# Altium schematic sheet Sheet1.SchDoc
size A; SheetNumber: 1; SheetTotal: 1
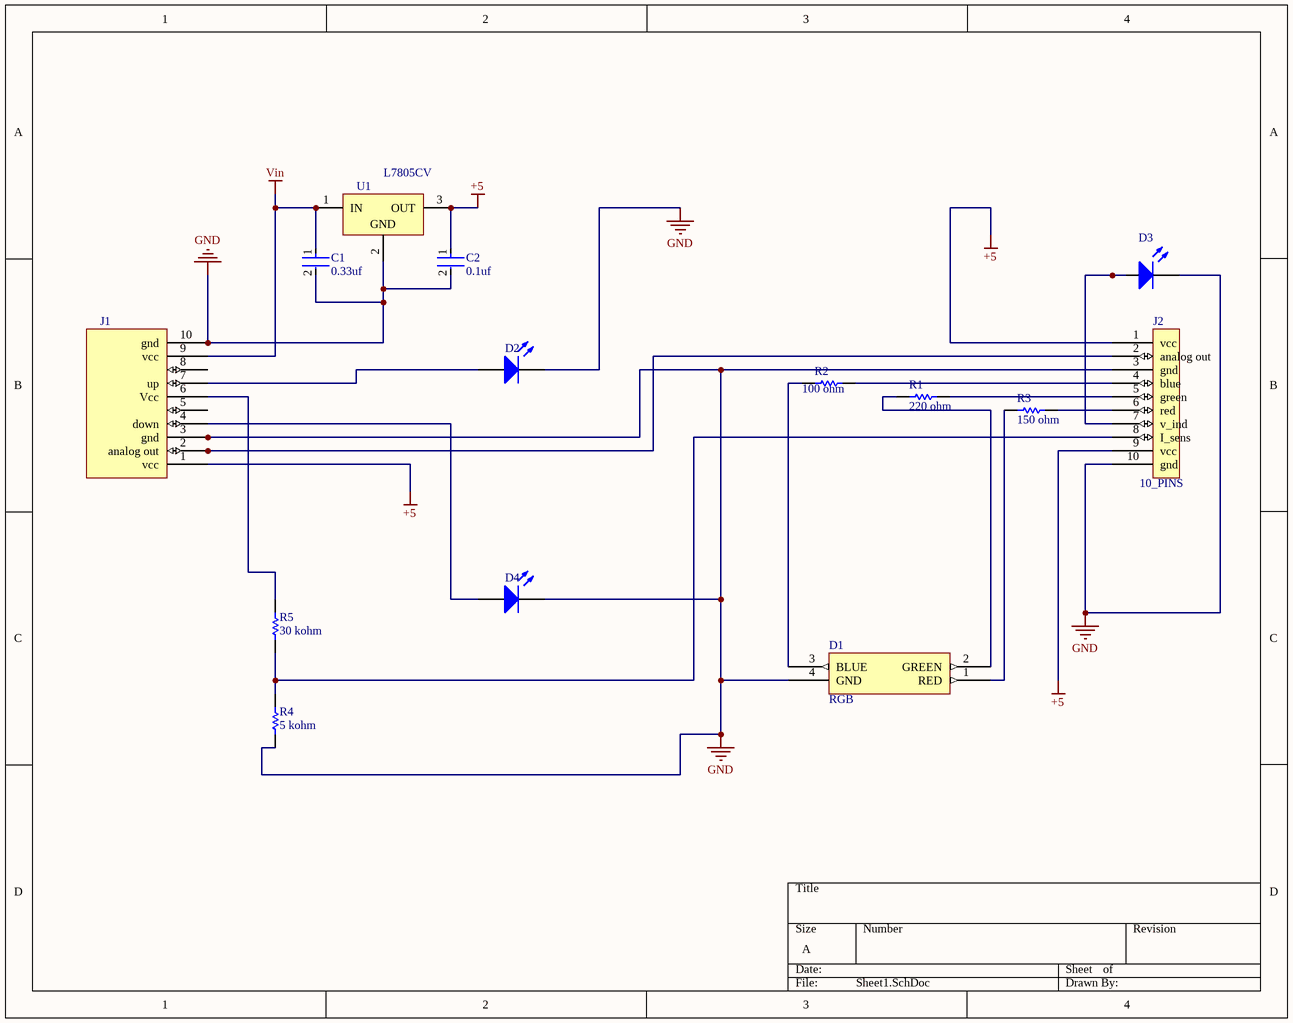
[diagram p0: Sheet1.SchDoc]

## Parts
C1  0.33uf  [FP-K15H5-MFG]
C2  0.1uf  [FP-K15H5-MFG]
D1  RGB  [RGB LED]
D2  Light-Emitting Diode  [LED]  (value not drawn)
D3  Light-Emitting Diode  [LED]  (value not drawn)
D4  Light-Emitting Diode  [LED]  (value not drawn)
J1  (no value)  [pin_10]
J2  10_PINS  [pin_10]
R1  value 220 ohm  [RESISTANCE]  (hidden comment: Resistor)
R2  value 100 ohm  [RESISTANCE]  (hidden comment: Resistor)
R3  value 150 ohm  [RESISTANCE]  (hidden comment: Resistor)
R4  value 5 kohm  [RESISTANCE]  (hidden comment: Resistor)
R5  value 30 kohm  [RESISTANCE]  (hidden comment: Resistor)
U1  L7805CV  [TO220]

## Nets
+5: C2.1 J1.1(vcc) J2.1(vcc) J2.9(vcc) U1.3(OUT)
GND: C1.2 C2.2 D1.4(GND) D2.2(K) D3.2(K) D4.2(K) J1.3(gnd) J1.10(gnd) J2.3(gnd) J2.10(gnd) R4.2 U1.2(GND)
Vin: C1.1 J1.9(vcc) U1.1(IN)
NetD1_1: D1.1(RED) R3.2
NetD1_2: D1.2(GREEN) R1.2
NetD1_3: D1.3(BLUE) R2.2
NetD2_1: D2.1(A) J1.7(up)
NetD3_1: D3.1(A) J2.7(v_ind)
NetD4_1: D4.1(A) J1.4(down)
NetJ1_2: J1.2(analog_out) J2.2(analog_out)
NetJ1_6: J1.6(Vcc) R5.1
NetJ2_4: J2.4(blue) R2.1
NetJ2_5: J2.5(green) R1.1
NetJ2_6: J2.6(red) R3.1
NetJ2_8: J2.8(I_sens) R4.1 R5.2

Not connected (* = marked no-connect by the designer): J1 5 8

## Library data of the parts
C1 C2 = CMP-02417-000078-1: CAP CER 0.1UF 50V X7R RADIAL; Capacitance: 100nF; Tolerance: 10%; Dielectric Material: Ceramic; Lead Length: 30mm; Lead Diameter: 0.5mm; Lead/Base Style: Formed Leads; Diameter: 500um; Max Operating Temperature: 125°C; Case/Package: Dipped; Dielectric: X7R; Lead Free: Lead Free; Construction: RADIAL; Voltage: 50V; Thickness: 2.6mm; Min Operating Temperature: -55°C; Lead Pitch: 5mm; Height: 4mm; Radiation Hardening: No; Voltage Rating: 50V; Depth: 2.5mm; Voltage Rating (DC): 50V; Package Quantity: 1; Weight: 0.005644oz; Series: K; Mount: Through Hole; Termination: Radial; Height - Seated (Max): 0.257inch; Length: 4mm; Packaging: Tape and Reel; Width: 2.5mm; RoHS Compliant: Yes
D1 = RGB LED
D2-D4 = LED: AF: 1; BV: 0; BV_MAX: 1e99; EG: 1.11; FC: 0.5; IBV: 0.001; IS: 1e-14; MJSW: 0.33; NTUN: 30; TNOM: 27; XTI: 3; SimulationGenericComponent: True; CJO: 0; CJP: 0; CTA: 0; CTP: 0; FCS: 0.5; FV_MAX: 1e99; IKF: 0; IKR: 0; ISR: 1e-14; JSW: 0; JTUN: 0; JTUNSW: 0; KEG: 1; KF: 0; LEVEL: 1; N: 1; NBV: 1; NR: 1; NS: 1; PHP: 1; RS: 0; TCV: 0; TLEV: 0; TLEVC: 0; TM1: 0; TM2: 0; TPB: 0; TPHP: 0; TRS: 0; TRS2: 0; TT: 0; TTT1: 0; TTT2: 0; VJ: 1; XTITUN: 3
J1 = pin_1
J2 = PIN_2
R1-R5 = Resistor: TC1: 0; SimulationGenericComponent: True; TC2: 0
U1 = CMP-0244-00483-1: Positive Voltage Regulator, 5V, 3-Pin TO-220; PackageDescription: TO, Thru-Hole, Vertical, Heatsink Mounted; 3 In-Line Leads; Pitch 2.54 mm; ComponentLink2Description: Datasheet; PackageReference: TO220; ComponentLink3URL: http://www.st.com/internet/com/TECHNICAL_RESOURCES/TECHNICAL_LITERATURE/PACKAGE_INFORMATION/CD00004649.pdf; DatasheetVersion: 16/11/2011; ComponentLink1Description: Manufacturer URL; ComponentLink1URL: http://www.st.com; PackageVersion: ver3.0; ComponentLink3Description: Package Specification; ComponentLink2URL: http://www.st.com/internet/com/TECHNICAL_RESOURCES/TECHNICAL_LITERATURE/DATASHEET/CD00000444.pdf